# Altium schematic sheet MCU.SchDoc: Microprocessor
size B; Date: 7/18/2023; CheckedBy: G Marquez; Author: G Marquez; Organization: ORGANIZATION; Address1: ADDRESS 1; Address2: ADDRESS 2; Address3: ADDRESS 3; Address4: ADDRESS 4; Revision: 01; SheetNumber: 3; SheetTotal: 5; Project: o-Macropad; ENG_APP_DATE: --/--/--; DSN_APP_DATE: --/--/--; CHK_APP_DATE: --/--/--
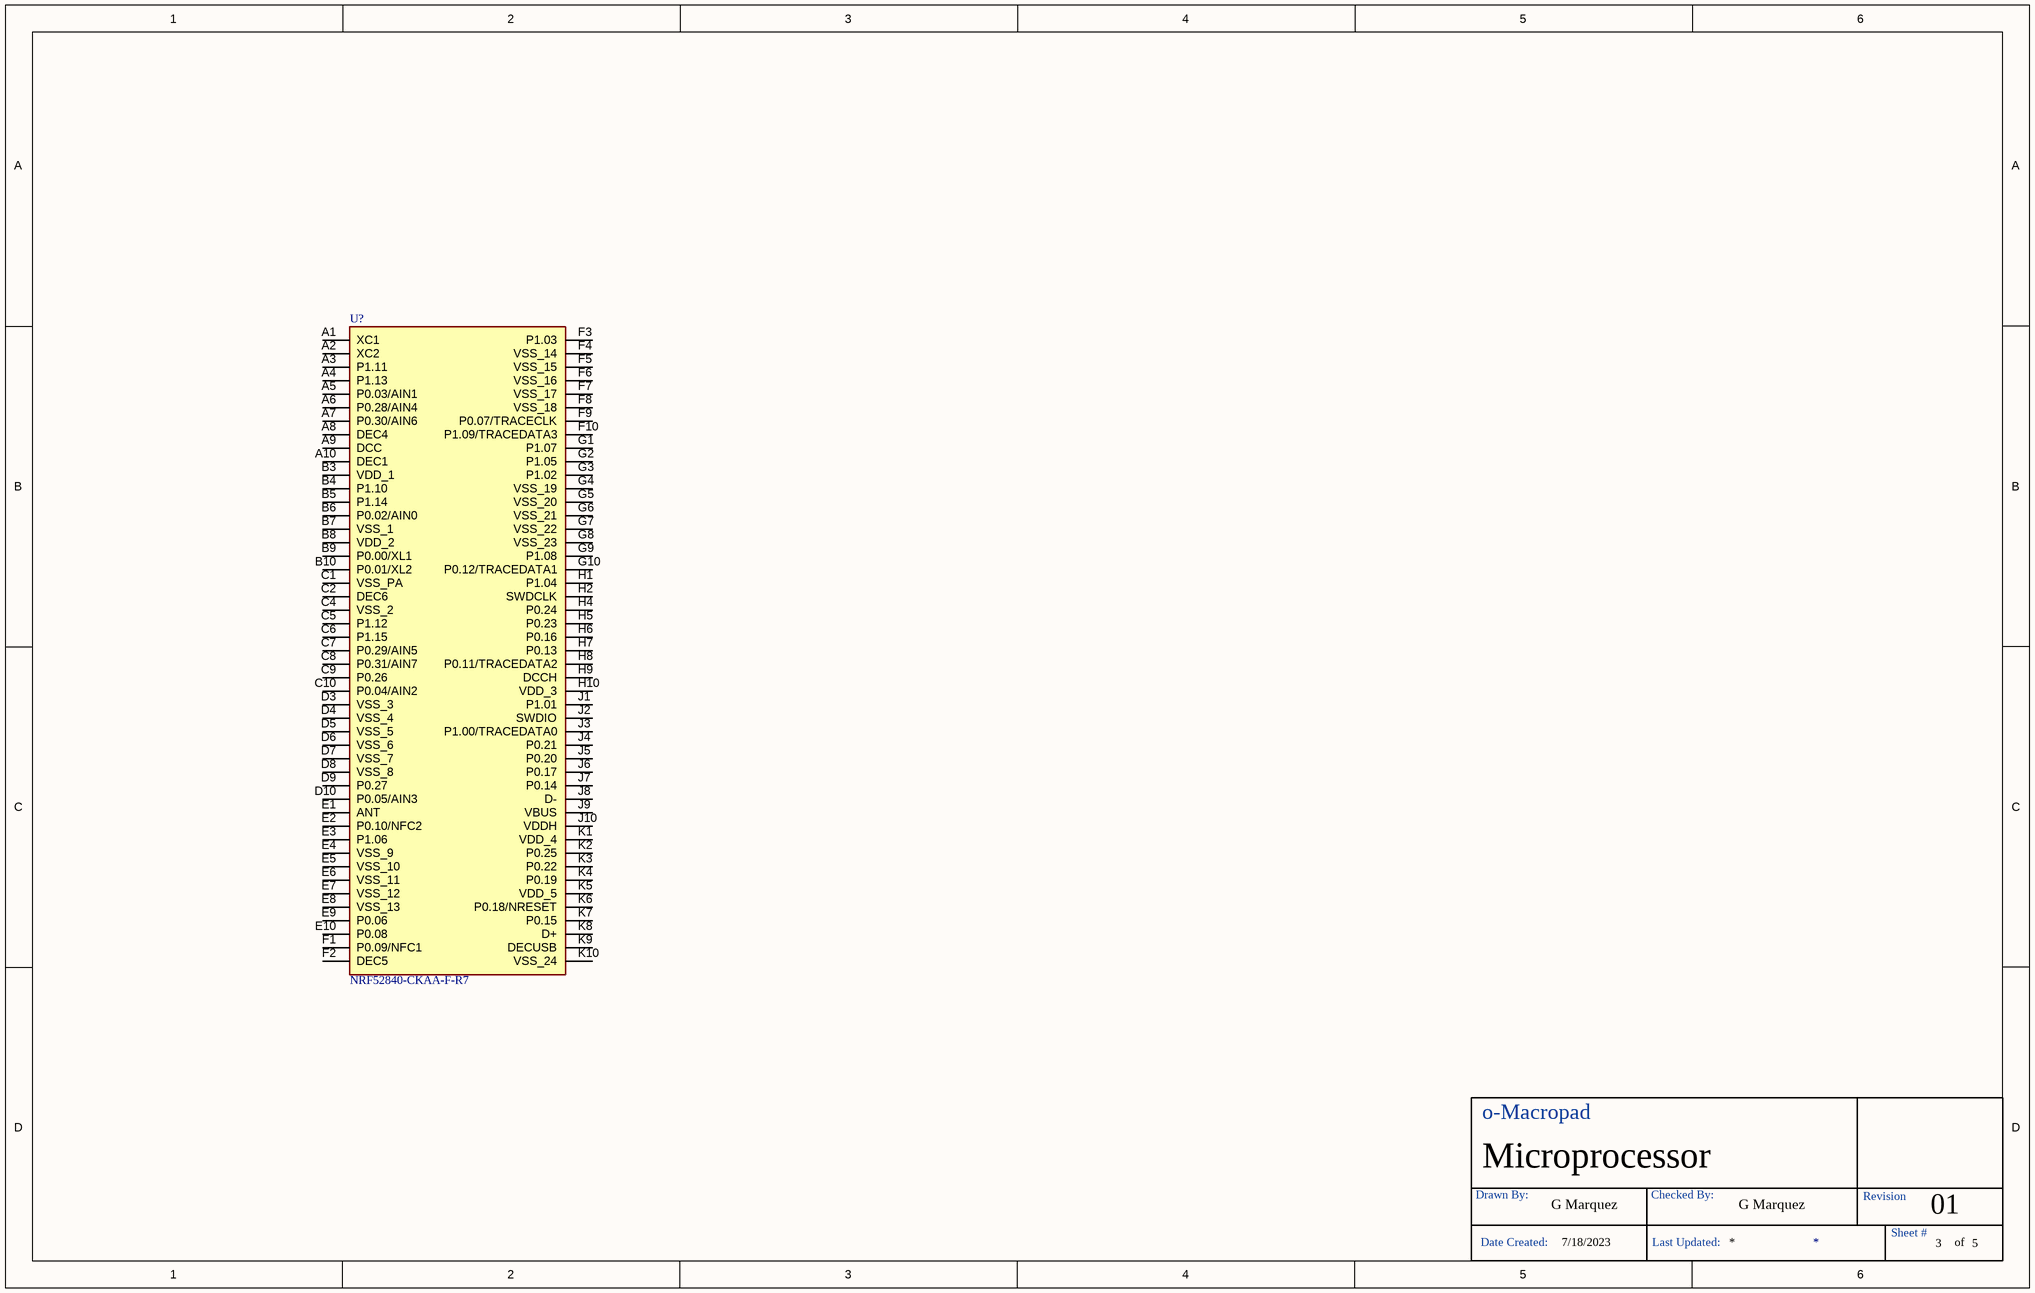
[diagram p0: MCU.SchDoc]

## Parts
*  Title Block  (value not drawn)
U?  NRF52840-CKAA-F-R7  [BGA94C35P10X10_354X361X51]

## Nets

Not connected (* = marked no-connect by the designer): U? A1(XC1) A2(XC2) A3(P1.11) A4(P1.13) A5(P0.03/AIN1) A6(P0.28/AIN4) A7(P0.30/AIN6) A8(DEC4) A9(DCC) A10(DEC1) B3(VDD_1) B4(P1.10) B5(P1.14) B6(P0.02/AIN0) B7(VSS_1) B8(VDD_2) B9(P0.00/XL1) B10(P0.01/XL2) C1(VSS_PA) C2(DEC6) C4(VSS_2) C5(P1.12) C6(P1.15) C7(P0.29/AIN5) C8(P0.31/AIN7) C9(P0.26) C10(P0.04/AIN2) D3(VSS_3) D4(VSS_4) D5(VSS_5) D6(VSS_6) D7(VSS_7) D8(VSS_8) D9(P0.27) D10(P0.05/AIN3) E1(ANT) E2(P0.10/NFC2) E3(P1.06) E4(VSS_9) E5(VSS_10) E6(VSS_11) E7(VSS_12) E8(VSS_13) E9(P0.06) E10(P0.08) F1(P0.09/NFC1) F2(DEC5) F3(P1.03) F4(VSS_14) F5(VSS_15) F6(VSS_16) F7(VSS_17) F8(VSS_18) F9(P0.07/TRACECLK) F10(P1.09/TRACEDATA3) G1(P1.07) G2(P1.05) G3(P1.02) G4(VSS_19) G5(VSS_20) G6(VSS_21) G7(VSS_22) G8(VSS_23) G9(P1.08) G10(P0.12/TRACEDATA1) H1(P1.04) H2(SWDCLK) H4(P0.24) H5(P0.23) H6(P0.16) H7(P0.13) H8(P0.11/TRACEDATA2) H9(DCCH) H10(VDD_3) J1(P1.01) J2(SWDIO) J3(P1.00/TRACEDATA0) J4(P0.21) J5(P0.20) J6(P0.17) J7(P0.14) J8(D-) J9(VBUS) J10(VDDH) K1(VDD_4) K2(P0.25) K3(P0.22) K4(P0.19) K5(VDD_5) K6(P0.18/NRESET) K7(P0.15) K8(D+) K9(DECUSB) K10(VSS_24)

## Notes on the sheet
- DWG. NO.
- REV.
- SHT.
- THIS DOCUMENT AND THE DATA DISCLOSED HEREIN OR HEREWITH IS THE PROPERTY OF ALTIUM LIMITED AND MAY BE FREELY DISTRIBUTED IN WHOLE. NO RIGHTS ARE RESERVED OR EXPRESS OR IMPLIED WARANTEE GIVEN.
- REVISION
- DESCRIPTION
- DATE
- APPROVED
- ENG:
- APPROVALS
- PROJECT
- DSN:
- CHK:
- REFERENCE DOCUMENTS
- PROJECT REVISION:
- TITLE
- DOCUMENT REVISION:
- DESIGN ITEM:
- BOM:
- FAB DWG:
- PCB DWG:
- ASSY DWG:
- SCALE:
- SIZE
- B
- CAGE CODE
- FILE NAME
- DWG NO.
- SHEET
- OF
- REV
- (in symbol Title Block) Drawn By:; Checked By:; Revision; Sheet #; Date Created:; Last Updated:; of

## Library data of the parts
U? = NRF52840-CKAA-F-R7: Integrated Circuit; Manufacturer_Name: Nordic Semiconductor; Datasheet Link: https://infocenter.nordicsemi.com/pdf/nRF52840_PS_v1.7.pdf; Height: 0.514mm; Manufacturer_Part_Number: NRF52840-CKAA-F-R7; Mouser Part Number: 949-NRF52840CKAAF-R7; Mouser Price/Stock: https://www.mouser.co.uk/ProductDetail/Nordic-Semiconductor/nRF52840-CKAA-F-R7?qs=TCDPyi3sCW3UO0%252BPeBf5YQ%3D%3D; Arrow Part Number: NRF52840-CKAA-F-R7; Arrow Price/Stock: https://www.arrow.com/en/products/nrf52840-ckaa-f-r7/nordic-semiconductor?utm_currency=USD&region=nac